# EAGLE design untitled (EAGLE 9.4.2)

## Sheet 1 of 2
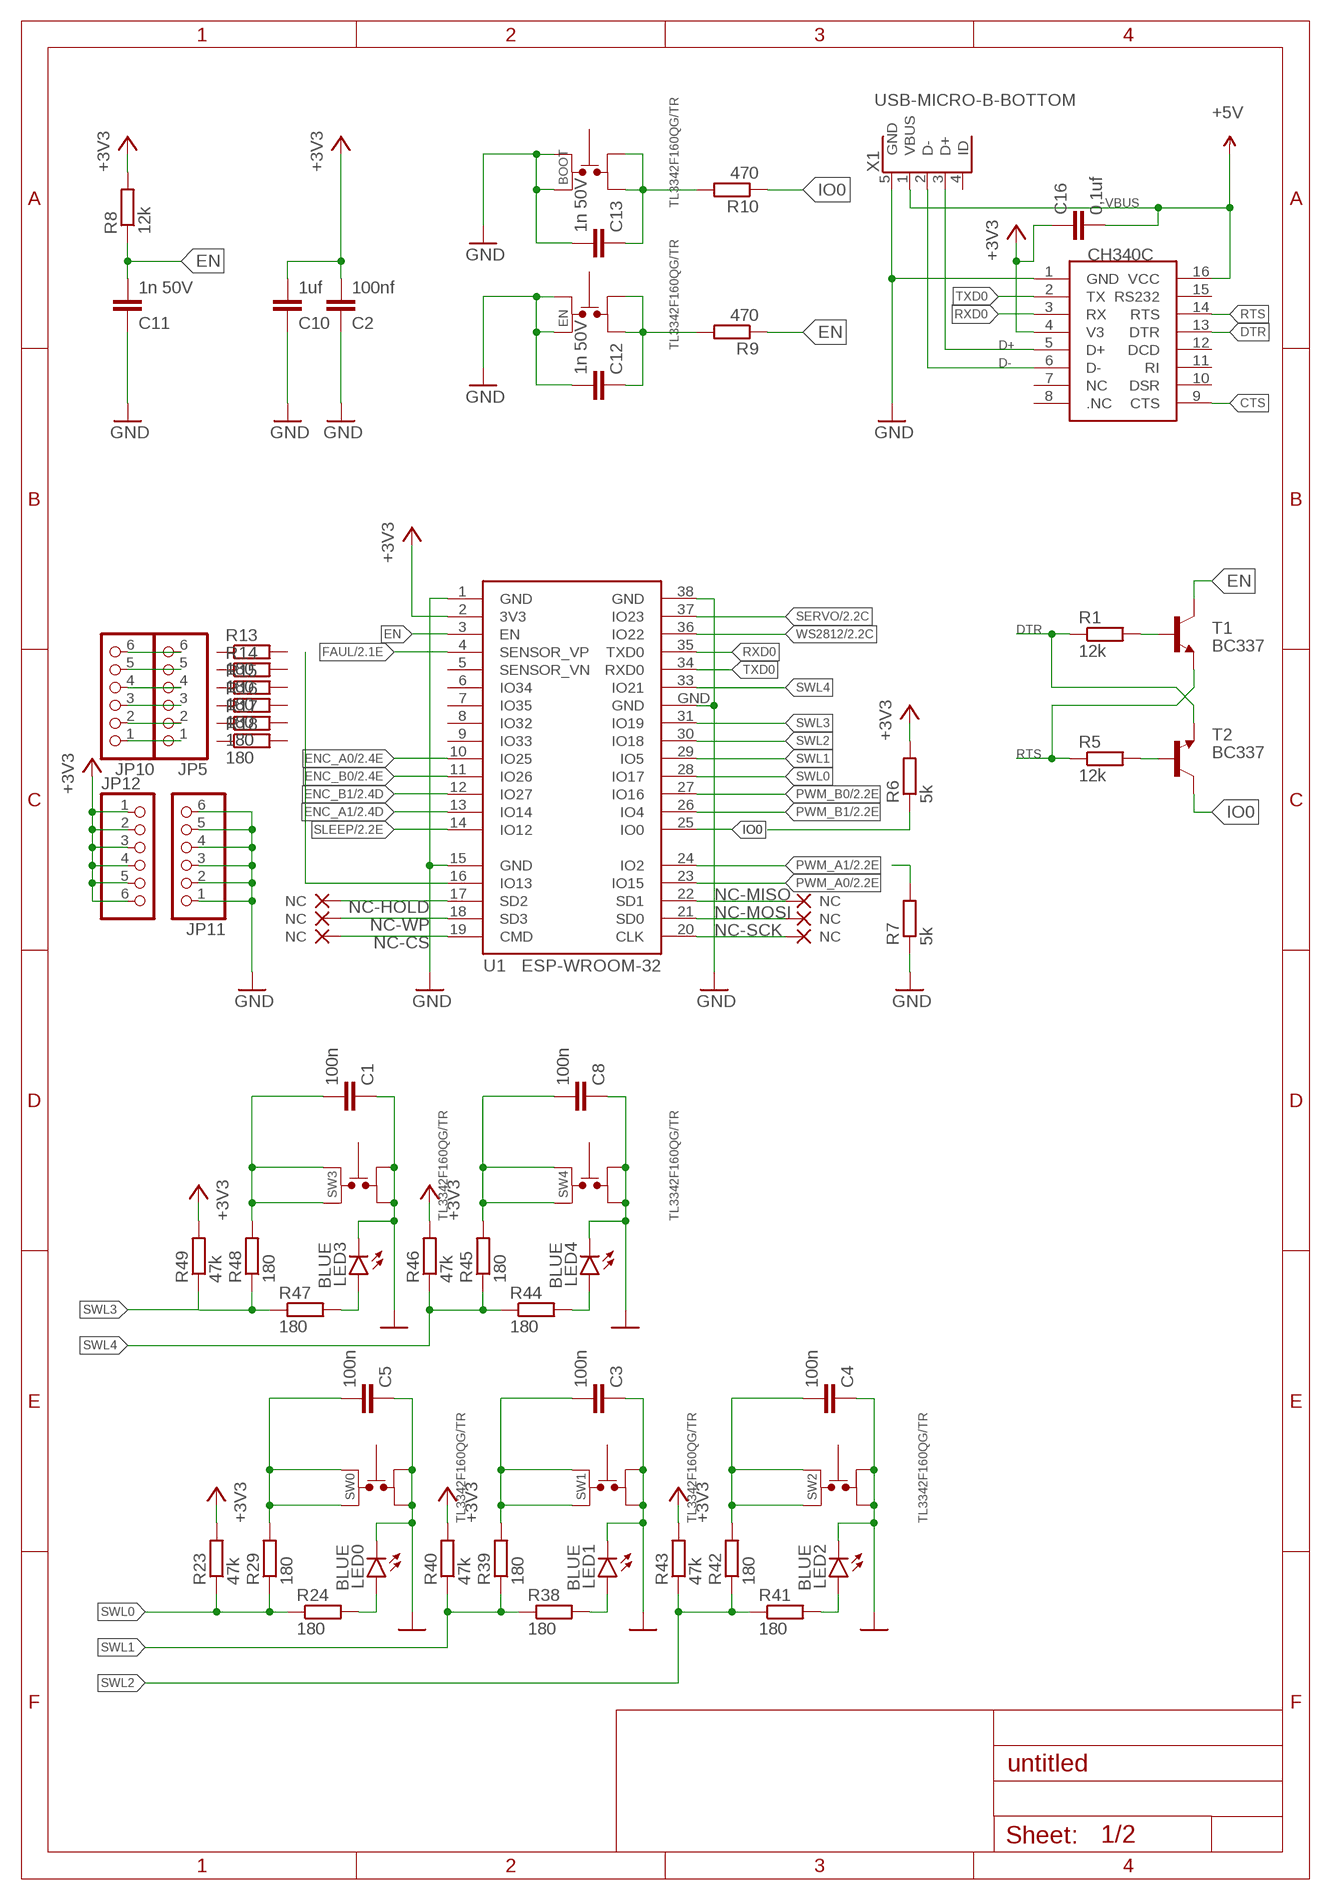
[diagram p0: schematic, sheet 1]

### Parts
BOOT  TL3342F160QG/TR  [TL3342F160QG/TR]
C1  100n  C-EUC0402K  [C0402K]
C2  100nf  C-EUC0402  [C0402]
C3  100n  C-EUC0402K  [C0402K]
C4  100n  C-EUC0402K  [C0402K]
C5  100n  C-EUC0402K  [C0402K]
C8  100n  C-EUC0402K  [C0402K]
C10  1uf  C-EUC0402  [C0402]
C11  1n 50V  C-EUC0402  [C0402]
C12  1n 50V  C-EUC0402K  [C0402K]
C13  1n 50V  C-EUC0402  [C0402]
C16  0,1uf  C-EUC0402  [C0402]
CH1  CH340C  [SOIC16]
EN  TL3342F160QG/TR  [TL3342F160QG/TR]
JP5  PINHD-1X6  [1X06]
JP10  PINHD-1X6  [1X06]
JP11  PINHD-1X6  [1X06]
JP12  PINHD-1X6  [1X06]
LED0  BLUE  LEDCHIPLED_1206  [CHIPLED_1206]
LED1  BLUE  LEDCHIPLED_1206  [CHIPLED_1206]
LED2  BLUE  LEDCHIPLED_1206  [CHIPLED_1206]
LED3  BLUE  LEDCHIPLED_1206  [CHIPLED_1206]
LED4  BLUE  LEDCHIPLED_1206  [CHIPLED_1206]
NC1  NC  (no package)
NC2  NC  (no package)
NC3  NC  (no package)
NC4  NC  (no package)
NC5  NC  (no package)
NC6  NC  (no package)
R1  12k  R-EU_R0603  [R0603]
R5  12k  R-EU_R0603  [R0603]
R6  5k  R-EU_R0402  [R0402]
R7  5k  R-EU_R0402  [R0402]
R8  12k  R-EU_R0402  [R0402]
R9  470  R-EU_R0402  [R0402]
R10  470  R-EU_R0402  [R0402]
R13  180  R-EU_R0402  [R0402]
R14  180  R-EU_R0402  [R0402]
R15  180  R-EU_R0402  [R0402]
R16  180  R-EU_R0402  [R0402]
R17  180  R-EU_R0402  [R0402]
R18  180  R-EU_R0402  [R0402]
R23  47k  R-EU_R0402  [R0402]
R24  180  R-EU_R0402  [R0402]
R29  180  R-EU_R0402  [R0402]
R38  180  R-EU_R0402  [R0402]
R39  180  R-EU_R0402  [R0402]
R40  47k  R-EU_R0402  [R0402]
R41  180  R-EU_R0402  [R0402]
R42  180  R-EU_R0402  [R0402]
R43  47k  R-EU_R0402  [R0402]
R44  180  R-EU_R0402  [R0402]
R45  180  R-EU_R0402  [R0402]
R46  47k  R-EU_R0402  [R0402]
R47  180  R-EU_R0402  [R0402]
R48  180  R-EU_R0402  [R0402]
R49  47k  R-EU_R0402  [R0402]
SW0  TL3342F160QG/TR  [TL3342F160QG/TR]
SW1  TL3342F160QG/TR  [TL3342F160QG/TR]
SW2  TL3342F160QG/TR  [TL3342F160QG/TR]
SW3  TL3342F160QG/TR  [TL3342F160QG/TR]
SW4  TL3342F160QG/TR  [TL3342F160QG/TR]
T1  BC337  NPN-SOT23-BEC  [SOT23]
T2  BC337  NPN-SOT23-BEC  [SOT23]
U1  ESP-WROOM-32  [ESP-WROOM-32]
X1  USB-MICRO-B-BOTTOM  [USB-MICRO-B-BOTTOM-MOLEX]

### Nets
!DTR_B: R1.2 T1.1(B)
!RTS_B: R5.2 T2.1(B)
+3V3: C2.2 C10.2 C16.1 CH1.4(V3) JP12.1 JP12.2 JP12.3 JP12.4 JP12.5 JP12.6 R6.2 R8.2 R23.2 R40.2 R43.2 R46.2 R49.2 U1.2(3V3) ; also sheet 2
CTS: CH1.9(CTS)
D+: CH1.5(D+) X1.3(D+)
D-: CH1.6(D-) X1.2(D-)
DTR: CH1.13(DTR) R1.1 T2.2(E)
EN: C11.2 R8.1 R9.1 T1.3(C) U1.3(EN)
ENC_A0: U1.10(IO25) ; also sheet 2
ENC_A1: U1.13(IO14) ; also sheet 2
ENC_B0: U1.11(IO26) ; also sheet 2
ENC_B1: U1.12(IO27) ; also sheet 2
FAUL: U1.4(SENSOR_VP) ; also sheet 2
GND: BOOT.3 BOOT.4 C1.1 C2.1 C3.1 C4.1 C5.1 C8.1 C10.1 C11.1 C12.2 C13.2 CH1.1(GND) EN.3 EN.4 JP11.1 JP11.2 JP11.3 JP11.4 JP11.5 JP11.6 LED0.C LED1.C LED2.C LED3.C LED4.C R7.1 SW0.1 SW0.2 SW1.1 SW1.2 SW2.1 SW2.2 SW3.1 SW3.2 SW4.1 SW4.2 U1.1(GND) U1.15(GND) U1.38(GND) U1.GND X1.5(GND) ; also sheet 2
IO0: R6.1 R10.1 T2.3(C) U1.25(IO0)
N$1: C12.1 EN.1 EN.2 R9.2
N$2: JP5.1 JP10.1
N$3: JP5.2 JP10.2
N$4: JP5.3 JP10.3
N$5: JP5.4 JP10.4
N$6: JP5.5 JP10.5
N$7: BOOT.1 BOOT.2 C13.1 R10.2
N$9: U1.16(IO13)
N$10: LED0.A R24.2
N$13: JP5.6 JP10.6
N$24: LED2.A R41.2
N$26: LED1.A R38.2
N$27: LED4.A R44.2
N$28: LED3.A R47.2
NC-CS: NC3.NC U1.19(CMD)
NC-HOLD: NC1.NC U1.17(SD2)
NC-MISO: NC6.NC U1.22(SD1)
NC-MOSI: NC5.NC U1.21(SD0)
NC-SCK: NC4.NC U1.20(CLK)
NC-WP: NC2.NC U1.18(SD3)
PWM_A0: U1.23(IO15) ; also sheet 2
PWM_A1: R7.2 U1.24(IO2) ; also sheet 2
PWM_B0: U1.27(IO16) ; also sheet 2
PWM_B1: U1.26(IO4) ; also sheet 2
RTS: CH1.14(RTS) R5.1 T1.2(E)
RXD0: CH1.3(RX) U1.35(TXD0)
SERVO: U1.37(IO23) ; also sheet 2
SLEEP: U1.14(IO12) ; also sheet 2
SW0: C5.2 R29.2 SW0.3 SW0.4
SW1: C3.2 R39.2 SW1.3 SW1.4
SW2: C4.2 R42.2 SW2.3 SW2.4
SW3: C1.2 R48.2 SW3.3 SW3.4
SW4: C8.2 R45.2 SW4.3 SW4.4
SWL0: R23.1 R24.1 R29.1 U1.28(IO17)
SWL1: R38.1 R39.1 R40.1 U1.29(IO5)
SWL2: R41.1 R42.1 R43.1 U1.30(IO18)
SWL3: R47.1 R48.1 R49.1 U1.31(IO19)
SWL4: R44.1 R45.1 R46.1 U1.33(IO21)
TXD0: CH1.2(TX) U1.34(RXD0)
VBUS: C16.2 CH1.16(VCC) X1.1(VBUS) ; supply symbol labelled +5V
WS2812: U1.36(IO22) ; also sheet 2
Unconnected: CH1.7(NC) CH1.8(.NC) CH1.10(DSR) CH1.11(RI) CH1.12(DCD) CH1.15(RS232) R13.1 R13.2 R14.1 R14.2 R15.1 R15.2 R16.1 R16.2 R17.1 R17.2 R18.1 R18.2 U1.5(SENSOR_VN) U1.6(IO34) U1.7(IO35) U1.8(IO32) U1.9(IO33) X1.4(ID)

## Sheet 2 of 2
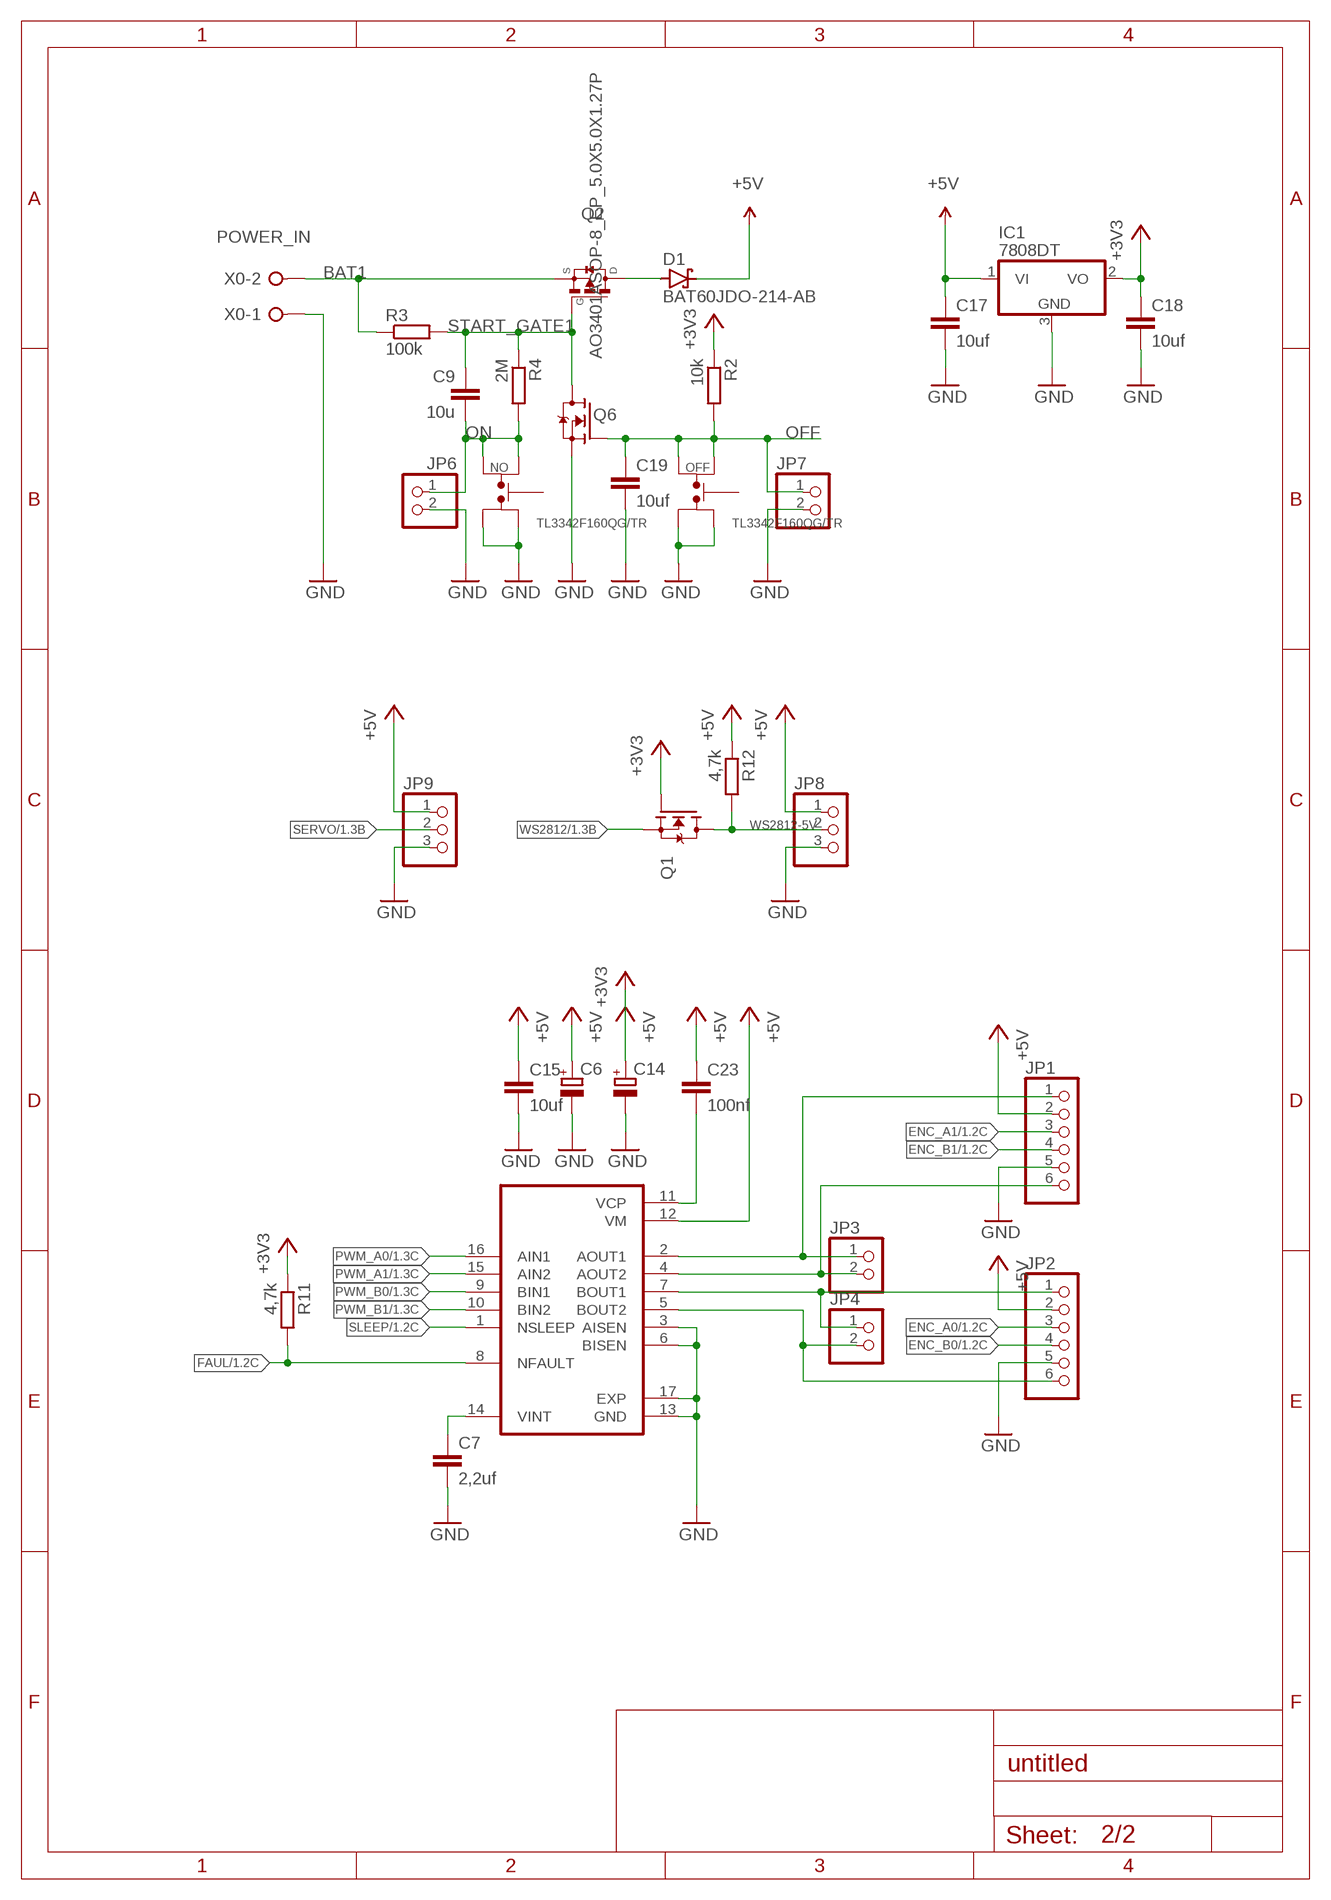
[diagram p1: schematic, sheet 2]

### Parts
C6  CPOL-EUSANYO_SMD_F8  [SANYO-OSCON_SMD_F8]
C7  2,2uf  C-EUC0402K  [C0402K]
C9  10u  C-EUC0402K  [C0402K]
C14  CPOL-EUSANYO_SMD_F8  [SANYO-OSCON_SMD_F8]
C15  10uf  C-EUC0603  [C0603]
C17  10uf  C-EUC0603  [C0603]
C18  10uf  C-EUC0603  [C0603]
C19  10uf  C-EUC0402K  [C0402K]
C23  100nf  C-EUC0402K  [C0402K]
D1  BAT60JDO-214-AB  [DO214BA]
IC1  7808DT  [TO252]
JP1  PINHD-1X6  [1X06]
JP2  PINHD-1X6  [1X06]
JP3  PINHD-1X2  [1X02]
JP4  PINHD-1X2  [1X02]
JP6  PINHD-1X2  [1X02]
JP7  PINHD-1X2  [1X02]
JP8  PINHD-1X3  [1X03]
JP9  PINHD-1X3  [1X03]
NO  TL3342F160QG/TR  [TL3342F160QG/TR]
OFF  TL3342F160QG/TR  [TL3342F160QG/TR]
Q1  N-MOSFET-SOT23-GSD  [SOT23]
Q2  AO3401ASOP-8_EP_5.0X5.0X1.27P  [SOP-8_EP_5.0X5.0X1.27P]
Q6  N-MOSFET-SOT23-GSD  [SOT23]
R2  10k  R-EU_R0402  [R0402]
R3  100k  R-EU_R0402  [R0402]
R4  2M  R-EU_R0402  [R0402]
R11  4,7k  R-EU_R0402  [R0402]
R12  4,7k  R-EU_R0402  [R0402]
U$9  DRV8833CPWPR  [SOP65P640X120-17N]
X0  POWER_IN  W237-02P  [W237-132]

### Nets
+3V3: C18.1 IC1.2(VO) Q1.1(G) R2.1 R11.1 ; also sheet 1
+5V: C6.+ C14.+ C15.1 C17.1 C23.2 D1.C IC1.1(VI) JP1.2 JP2.2 JP8.1 JP9.1 R12.1 U$9.12(VM) ; supply symbol labelled +3V3
BAT1: Q2.1(S) Q2.2(S) Q2.3(S) R3.1 X0.2
ENC_A0: JP2.3 ; also sheet 1
ENC_A1: JP1.3 ; also sheet 1
ENC_B0: JP2.4 ; also sheet 1
ENC_B1: JP1.4 ; also sheet 1
FAUL: R11.2 U$9.8(NFAULT) ; also sheet 1
GND: C6.- C7.2 C14.- C15.2 C17.2 C18.2 C19.2 IC1.3(GND) JP1.5 JP2.5 JP6.2 JP7.2 JP8.3 JP9.3 NO.1 NO.2 OFF.1 OFF.2 Q6.2(S) U$9.3(AISEN) U$9.6(BISEN) U$9.13(GND) U$9.17(EXP) X0.1 ; also sheet 1
N$8: JP1.1 JP3.1 U$9.2(AOUT1)
N$11: D1.A Q2.5(D) Q2.6(D) Q2.7(D) Q2.8(D) Q2.9(D)
N$12: C23.1 U$9.11(VCP)
N$14: JP1.6 JP3.2 U$9.4(AOUT2)
N$15: JP2.1 JP4.1 U$9.7(BOUT1)
N$16: JP2.6 JP4.2 U$9.5(BOUT2)
N$23: C7.1 U$9.14(VINT)
OFF: C19.1 JP7.1 OFF.3 OFF.4 Q6.1(G) R2.2
ON: C9.2 JP6.1 NO.3 NO.4 R4.2
PWM_A0: U$9.16(AIN1) ; also sheet 1
PWM_A1: U$9.15(AIN2) ; also sheet 1
PWM_B0: U$9.9(BIN1) ; also sheet 1
PWM_B1: U$9.10(BIN2) ; also sheet 1
SERVO: JP9.2 ; also sheet 1
SLEEP: U$9.1(NSLEEP) ; also sheet 1
START_GATE1: C9.1 Q2.4(G) Q6.3(D) R3.2 R4.1
WS2812: Q1.2(S) ; also sheet 1
WS2812-5V: JP8.2 Q1.3(D) R12.2

## Library data of the parts
BOOT EN NO OFF SW0 SW1-SW4 = Switch:TL3342F160QG/TR: SWITCH TACTILE SPST-NO 0.05A 12V Manufacturer's datasheet <http://spec_sheets.e-switch.com/specs/P010632.pdf>; CREATED_BY: PCBLayout.com; DIGI_KEY_PART_NUMBER: EG2531CT-ND; MANUFACTURER: E-Switch; MPN: TL3342F160QG/TR; PACKAGE: SPST_NO
C1-C5 C8-C13 = rcl_upravena:C-EU: CAPACITOR, European symbol
C6 C14 = rcl:CPOL-EU: POLARIZED CAPACITOR, European symbol; SPICEPREFIX: C
C7 C19 C23 = resistor:C-EU: CAPACITOR, European symbol
C15-C18 = rcl:C-EU: CAPACITOR, European symbol; SPICEPREFIX: C
CH1 = ch340g:CH340C
D1 = diode:BAT60J: Schottky barrier diode Source: www.st.com, BAT60J.pdf
IC1 = adafruit:78*: Positive VOLTAGE REGULATOR Added bigger pads to the TO-92 package
JP1 JP2 JP5 JP10-JP12 = pinhead:PINHD-1X6: PIN HEADER
JP3 JP4 JP6 JP7 = pinhead:PINHD-1X2: PIN HEADER
JP8 JP9 = pinhead:PINHD-1X3: PIN HEADER
LED0 LED1-LED4 = led:LED: LED OSRAM: - CHIPLED LG R971, LG N971, LY N971, LG Q971, LY Q971, LO R971, LY R971 LH N974, LH R974 LS Q976, LO Q976, LY Q976 LO Q996 - Hyper CHIPLED LW Q18S LB Q993, LB Q99A, LB R99A - SideLED LS A670, LO A670, LY A670, LG A670, LP A670 LB A673, LV A673, LT A673, LW A673 LH A674 LY A675 LS A676, LA A676, LO A676, LY A676, LW A676 LS A679, LY A679, LG A679 - Hyper Micro SIDELED® LS Y876, LA Y876, LO Y876, LY Y876 LT Y87S - SmartLED LW L88C, LW L88S LB L89C, LB L89S, LG L890 LS L89K, LO L89K, LY L89K LS L896, LA L896, LO L896, LY L896 - TOPLED LS T670, LO T670, LY T670, LG T670, LP T670 LSG T670, LSP T670, LSY T670, LOP T670, LYG T670 LG T671, LOG T671, LSG T671 LB T673, LV T673, LT T673, LW T673 LH T674 LS T676, LA T676, LO T676, LY T676, LB T676, LH T676, LSB T676, LW T676 LB T67C, LV T67C, LT T67C, LS T67K, LO T67K, LY T67K, LW E67C LS E67B, LA E67B, LO E67B, LY E67B, LB E67C, LV E67C, LT E67C LW T67C LS T679, LY T679, LG T679 LS T770, LO T770, LY T770, LG T770, LP T770 LB T773, LV T773, LT T773, LW T773 LH T774 LS E675, LA E675, LY E675, LS T675 LS T776, LA T776, LO T776, LY T776, LB T776 LHGB T686 LT T68C, LB T68C - Hyper Mini TOPLED® LB M676 - Mini TOPLED Santana® LG M470 LS M47K, LO M47K, LY M47K Source: http://www.osram.convergy.de LUXEON: - LUMILED® LXK2-PW12-R00, LXK2-PW12-S00, LXK2-PW14-U00, LXK2-PW14-V00 LXK2-PM12-R00, LXK2-PM12-S00, LXK2-PM14-U00 LXK2-PE12-Q00, LXK2-PE12-R00, LXK2-PE12-S00, LXK2-PE14-T00, LXK2-PE14-U00 LXK2-PB12-K00, LXK2-PB12-L00, LXK2-PB12-M00, LXK2-PB14-N00, LXK2-PB14-P00, LXK2-PB14-Q00 LXK2-PR12-L00, LXK2-PR12-M00, LXK2-PR14-Q00, LXK2-PR14-R00 LXK2-PD12-Q00, LXK2-PD12-R00, LXK2-PD12-S00 LXK2-PH12-R00, LXK2-PH12-S00 LXK2-PL12-P00, LXK2-PL12-Q00, LXK2-PL12-R00 Source: www.luxeon.com KINGBRIGHT: KA-3528ASYC Source: www.kingbright.com
NC1-NC6 = NC:NC: _EXTERNAL_
Q1 Q6 = transistors:N-MOSFET
Q2 = transistor-fet:AO3401A: P-Channel Enhancement MOSFET
R1-R10 = rcl_upravena:R-EU_: RESISTOR, European symbol
R11 R12 = rcl:R-EU_: RESISTOR, European symbol; SPICEPREFIX: R
R13-R18 R23 R24 R29 R38-R49 = resistor:R-EU_: RESISTOR, European symbol
T1 T2 = transistors:NPN
U1 = esp32:ESP-WROOM-32: Espressif Systems ESP-WROOM-32
U$9 = DRV8833CPWPR:DRV8833CPWPR: 1A Low Voltage Stepper or Single/Dual Brushed DC Motor Driver (PWM Ctrl) 16-HTSSOP -40 to 85; AVAILABILITY: Unavailable; DESCRIPTION: Motor Driver Power MOSFET PWM 16-HTSSOP; MF: Texas Instruments; MP: DRV8833CPWPR; PACKAGE: HTSSOP-16 Texas Instruments; PRICE: None
X0 = con-wago-508:W237-02P: WAGO SREW CLAMP; OC_FARNELL: unknown; OC_NEWARK: unknown
X1 = usb:USB

## Net classes
0 default: width 0.2 mm, drill 0.35 mm, clearance 0.2 mm

## Board
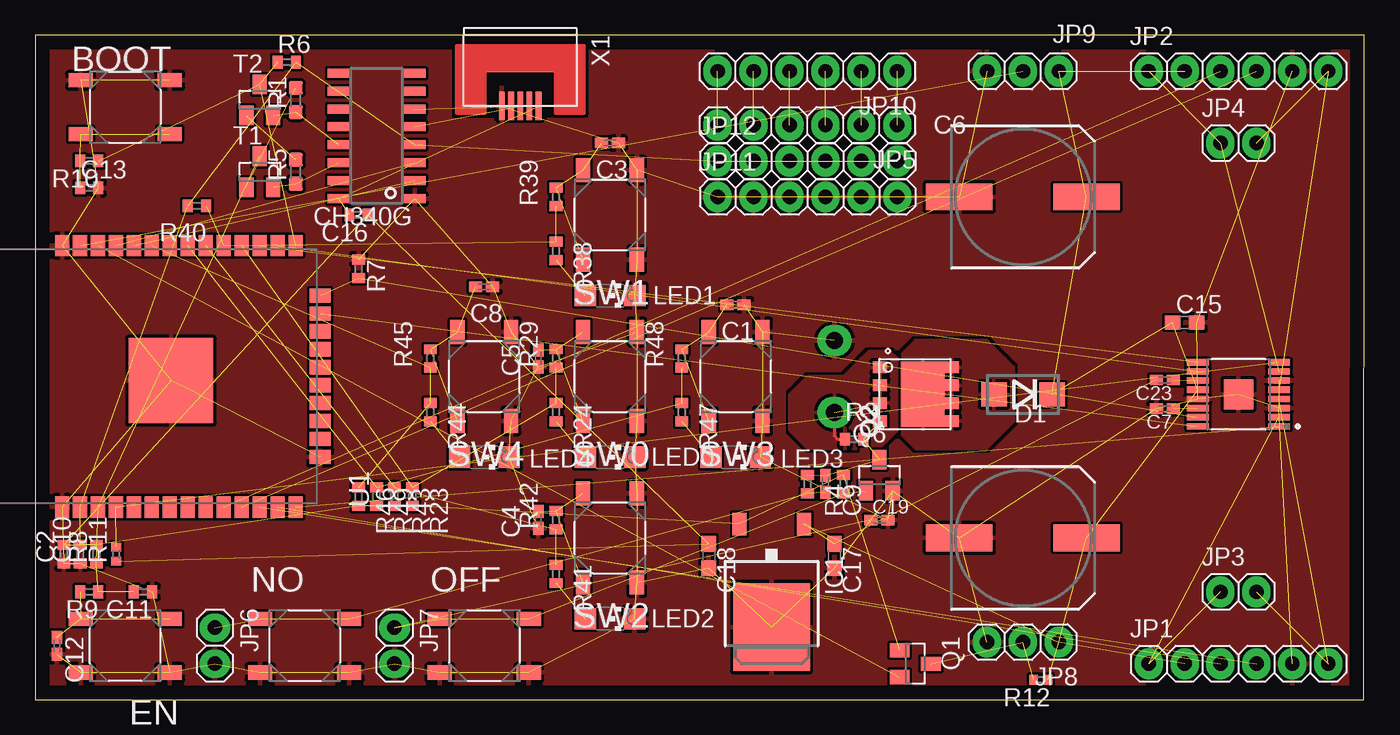
[diagram p2: board, top side]
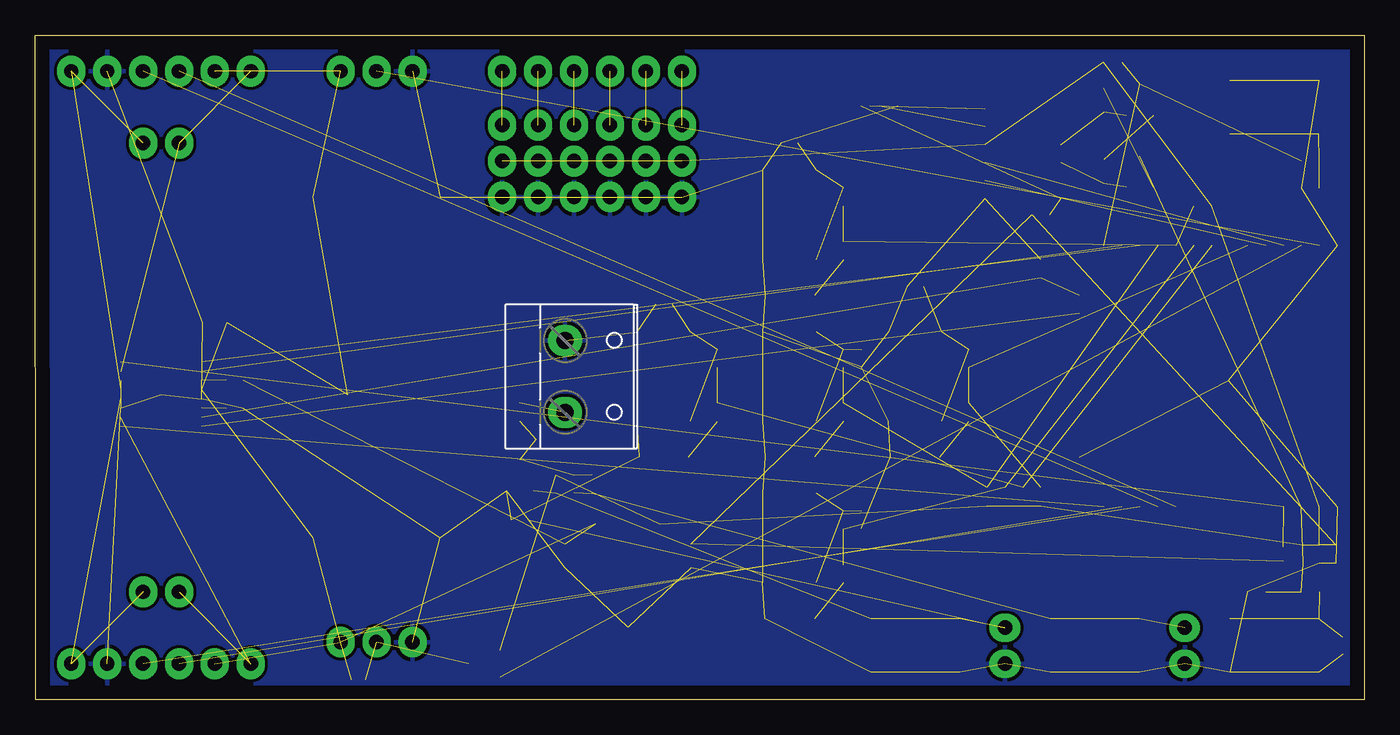
[diagram p3: board, bottom side, seen from below]

Size 93.98 x 46.99 mm. Coordinates in mm from the lower left corner, seen from the top.
Outline: 0,0 93.96,0 93.98,46.99 0,46.99 0,0
Copper layers (1*16): Top 0.035mm / dielectric 1.5mm / Bottom 0.035mm
Design rules "default *": minimum track width 6mil, minimum drill 0.35mm, track to track 6mil, track to pad 6mil, pad to pad 6mil, via to via 6mil, smd to smd 6mil, copper to edge 40mil, drill to drill 6mil, minimum pad ring 20mil, minimum via ring 8mil, stop-mask expansion 4mil, vias tented up to drill 0.5mm, thermal gap 10mil

### Footprints (pad centres in the part's own frame; a part is rotated, then mirrored left to right if it is on the bottom)
TL3342F160QG/TR = smd 1.7 x 1: 1 -3.15,-1.9; 2 3.15,-1.9; 3 -3.15,1.9; 4 3.15,1.9
C0402K = smd 0.925 x 0.74: 1 -0.6,0; 2 0.6,0
C0402 = smd 0.7 x 0.9: 1 -0.65,0; 2 0.65,0
SANYO-OSCON_SMD_F8 = smd 4.7 x 1.9: + 4.5,0; - -4.5,0
C0603 = smd 1.1 x 1: 1 -0.85,0; 2 0.85,0
SOIC16 = smd 0.635 x 1.524: 1 -4.445,-2.695; 2 -3.175,-2.695; 3 -1.905,-2.695; 4 -0.635,-2.695; 5 0.635,-2.695; 6 1.905,-2.695; 7 3.175,-2.695; 8 4.445,-2.695; 9 4.445,2.695; 10 3.175,2.695; 11 1.905,2.695; 12 0.635,2.695; 13 -0.635,2.695; 14 -1.905,2.695; 15 -3.175,2.695; 16 -4.445,2.695
DO214BA = smd 1.8 x 1.7: A 2.05,0; C -2.05,0
TO252 = smd 1 x 1.6: 1 -2.28,-4.8; 2 2.28,-4.8 | smd 5.4 x 6.2: 3 0,2.5
1X06 = drill 1.016 long: 1 -6.35,0; 2 -3.81,0; 3 -1.27,0; 4 1.27,0; 5 3.81,0; 6 6.35,0
1X02 = drill 1.016 long: 1 -1.27,0; 2 1.27,0
1X03 = drill 1.016 long: 1 -2.54,0; 2 0,0; 3 2.54,0
CHIPLED_1206 = smd 1.5 x 1.5: A 0,-1.75; C 0,1.75
SOT23 = smd 1 x 1.4: 1 -0.95,-1.1; 2 0.95,-1.1; 3 0,1.1
SOP-8_EP_5.0X5.0X1.27P = smd 0.8 x 1: 1 1.915,2.5; 2 0.645,2.5; 3 -0.625,2.5; 4 -1.895,2.5; 5 -1.895,-2.58; 6 -0.625,-2.58; 7 0.645,-2.58; 8 1.915,-2.58 | smd 4.61 x 3.1: 9 0.01,-0.53
R0603 = smd 1 x 1: 1 -0.85,0; 2 0.85,0
R0402 = smd 0.7 x 0.9: 1 -0.65,0; 2 0.65,0
R0402' = smd 0.6 x 0.7: 1 -0.5,0; 2 0.5,0
ESP-WROOM-32 = smd 1.5 x 1: 1 -9.25,7; 2 -9.25,5.73; 3 -9.25,4.46; 4 -9.25,3.19; 5 -9.25,1.92; 6 -9.25,0.65; 7 -9.25,-0.62; 8 -9.25,-1.89; 9 -9.25,-3.16; 10 -9.25,-4.43; 11 -9.25,-5.7; 12 -9.25,-6.97; 13 -9.25,-8.24; 14 -9.25,-9.51; 25 9.25,-9.51; 26 9.25,-8.24; 27 9.25,-6.97; 28 9.25,-5.7; 29 9.25,-4.43; 30 9.25,-3.16; 31 9.25,-1.89; 32 9.25,-0.62; 33 9.25,0.65; 34 9.25,1.92; 35 9.25,3.19; 36 9.25,4.46; 37 9.25,5.73; 38 9.25,7 | smd 1 x 1.5: 15 -5.7,-11.25; 16 -4.43,-11.25; 17 -3.16,-11.25; 18 -1.89,-11.25; 19 -0.62,-11.25; 20 0.65,-11.25; 21 1.92,-11.25; 22 3.19,-11.25; 23 4.46,-11.25; 24 5.73,-11.25 | smd 6 x 6: GND -0.3,-0.7
SOP65P640X120-17N = smd 1.57 x 0.41: 1 -2.87,2.275; 2 -2.87,1.625; 3 -2.87,0.975; 4 -2.87,0.325; 5 -2.87,-0.325; 6 -2.87,-0.975; 7 -2.87,-1.625; 8 -2.87,-2.275; 9 2.87,-2.275; 10 2.87,-1.625; 11 2.87,-0.975; 12 2.87,-0.325; 13 2.87,0.325; 14 2.87,0.975; 15 2.87,1.625; 16 2.87,2.275 | smd 2.07 x 2.105: 17 0,0
W237-132 = drill 1.194 long: 1 -2.54,-0.635; 2 2.54,-0.635
USB-MICRO-B-BOTTOM-MOLEX = smd 2 x 0.4: 1 5,1.3; 2 5,0.65; 3 5,0; 4 5,-0.65; 5 5,-1.3

### Placement (x,y rotation side)
BOOT  6.35,41.91 0 top
C1  49.53,27.94 180 top
C2  2.02,10.29 90 top
C3  40.64,39.37 180 top
C4  35.56,12.7 90 top
C5  35.56,24.13 90 top
C6  69.85,35.56 0 top
C7  79.88,20.57 180 top
C8  31.75,29.21 180 top
C9  55.88,15.24 270 top
C10  3.17,10.29 90 top
C11  7.62,7.62 180 top
C12  1.52,3.81 270 top
C13  3.81,36.2 0 top
C14  69.85,11.43 0 top
C15  81.28,26.67 0 top
C16  22.86,34.29 180 top
C17  56.52,10.16 270 top
C18  47.62,10.16 270 top
C19  59.69,12.7 0 top
C23  79.88,22.61 180 top
CH1  24.13,39.88 90 top
D1  69.85,21.59 180 top
EN  6.35,3.81 180 top
IC1  52.07,7.62 180 top
JP1  85.09,2.54 0 top
JP2  85.09,44.45 0 top
JP3  85.09,7.62 0 top
JP4  85.09,39.37 0 top
JP5  54.61,40.64 180 top
JP6  12.7,3.81 270 top
JP7  25.4,3.81 270 top
JP8  69.85,4.06 180 top
JP9  69.85,44.45 180 top
JP10  54.61,44.45 180 top
JP11  54.61,35.56 0 top
JP12  54.61,38.1 0 top
LED0  40.64,17.14 270 top
LED1  40.64,28.57 270 top
LED2  40.64,5.71 270 top
LED3  49.53,17.14 270 top
LED4  31.75,17.14 270 top
NO  19.05,3.81 0 top
OFF  31.75,3.81 0 top
Q1  62.23,2.54 270 top
Q2  62.23,21.59 90 top
Q6  59.69,15.88 0 top
R1  18.41,42.42 90 top
R2  57.15,15.24 270 top
R3  57.91,18.41 0 top
R4  54.61,15.24 270 top
R5  18.41,37.34 90 top
R6  17.78,45.09 0 top
R7  22.86,30.48 270 top
R8  4.32,10.29 90 top
R9  3.81,7.62 180 top
R10  3.81,38.1 180 top
R11  4,7k  [R0402']  5.71,10.29 90 top
R12  4,7k  [R0402']  71.12,1.4 180 top
R13  -11.43,-6.35 0 top  (outside the outline)
R14  -11.43,-11.43 0 top  (outside the outline)
R15  -11.43,-16.51 0 top  (outside the outline)
R16  -11.43,-21.59 0 top  (outside the outline)
R17  -11.43,-26.67 0 top  (outside the outline)
R18  -11.43,-31.75 0 top  (outside the outline)
R23  26.67,14.35 270 top
R24  36.83,20.32 270 top
R29  36.83,24.13 90 top
R38  36.83,31.75 270 top
R39  36.83,35.56 90 top
R40  11.43,34.92 180 top
R41  36.83,8.89 270 top
R42  36.83,12.7 90 top
R43  25.4,14.35 270 top
R44  27.94,20.32 270 top
R45  27.94,24.13 90 top
R46  22.86,14.35 270 top
R47  45.72,20.32 270 top
R48  45.72,24.13 90 top
R49  24.13,14.35 270 top
SW0  40.64,22.86 90 top
SW1  40.64,34.29 90 top
SW2  40.64,11.43 90 top
SW3  49.53,22.86 90 top
SW4  31.75,22.86 90 top
T1  15.88,37.34 0 top
T2  15.88,42.42 0 top
U1  8.89,22.86 90 top
U$9  85.09,21.59 180 top
X0  55.88,22.86 270 bottom
X1  34.29,46.99 270 top

### Tracks (layer width: path | path; a pad name or v marks a point on that pad's centre or on a via)
!DTR_B  (1 unrouted)
!RTS_B  (1 unrouted)
+3V3  (22 unrouted)
+5V  (12 unrouted)
BAT1  (1 unrouted)
  Top 0.2: X0.2 56.52,18.67 56.77,18.41 R3.1
  pour Top: 53.34,21.59 53.34,19.05 54.61,17.78 58.42,17.78 59.69,17.78 60.96,19.05 60.96,24.13 60.45,24.64 59.69,24.64 58.93,24.64 58.42,24.13 57.15,22.86 54.61,22.86
D+  (1 unrouted)
D-  (1 unrouted)
DTR  (2 unrouted)
EN  (4 unrouted)
ENC_A0  (1 unrouted)
ENC_A1  (1 unrouted)
ENC_B0  (1 unrouted)
ENC_B1  (1 unrouted)
FAUL  (2 unrouted)
GND  (65 unrouted)
  pour Top (rank 6): -1.27,48.26 95.25,48.26 95.25,-1.27 -1.27,-1.27
  pour Bottom (rank 6): -2.54,49.53 96.52,49.53 96.52,-2.54 -2.54,-2.54
IO0  (3 unrouted)
N$1  (3 unrouted)
N$2  (1 unrouted)
N$3  (1 unrouted)
N$4  (1 unrouted)
N$5  (1 unrouted)
N$6  (1 unrouted)
N$7  (3 unrouted)
N$8  (2 unrouted)
N$10  (1 unrouted)
N$11
  pour Top (rank 2): 68.58,24.13 67.31,25.4 62.23,25.4 60.96,24.13 60.96,19.05 62.23,17.78 67.31,17.78 69.22,19.68 69.22,23.11 69.22,23.5
N$12  (1 unrouted)
N$13  (1 unrouted)
N$14  (2 unrouted)
N$15  (2 unrouted)
N$16  (2 unrouted)
N$23  (1 unrouted)
N$24  (1 unrouted)
N$26  (1 unrouted)
N$27  (1 unrouted)
N$28  (1 unrouted)
OFF  (5 unrouted)
ON  (4 unrouted)
PWM_A0  (1 unrouted)
PWM_A1  (2 unrouted)
PWM_B0  (1 unrouted)
PWM_B1  (1 unrouted)
RTS  (2 unrouted)
RXD0  (1 unrouted)
SERVO  (1 unrouted)
SLEEP  (1 unrouted)
START_GATE1  (4 unrouted)
SW0  (3 unrouted)
SW1  (3 unrouted)
SW2  (3 unrouted)
SW3  (3 unrouted)
SW4  (3 unrouted)
SWL0  (3 unrouted)
SWL1  (3 unrouted)
SWL2  (3 unrouted)
SWL3  (3 unrouted)
SWL4  (3 unrouted)
TXD0  (1 unrouted)
VBUS  (2 unrouted)
WS2812  (1 unrouted)
WS2812-5V  (2 unrouted)